# Altium schematic sheet main.SchDoc: LoRaWAN Gateway
size A4; DrawnBy: Lucas Liaño; Organization: UTN-FRBA; Revision: 1; SheetNumber: 1; SheetTotal: 1
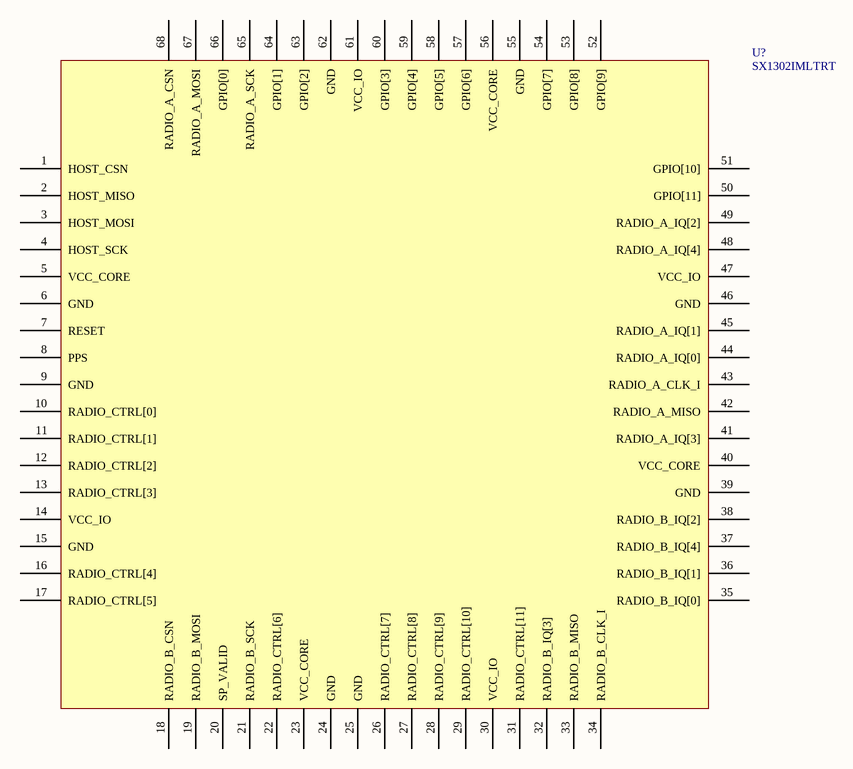
[diagram p0: main.SchDoc]

## Parts
U?  SX1302IMLTRT

## Nets

Not connected (* = marked no-connect by the designer): U? 1(HOST_CSN) 2(HOST_MISO) 3(HOST_MOSI) 4(HOST_SCK) 5(VCC_CORE) 6(GND) 7(RESET) 8(PPS) 9(GND) 10(RADIO_CTRL[0]) 11(RADIO_CTRL[1]) 12(RADIO_CTRL[2]) 13(RADIO_CTRL[3]) 14(VCC_IO) 15(GND) 16(RADIO_CTRL[4]) 17(RADIO_CTRL[5]) 18(RADIO_B_CSN) 19(RADIO_B_MOSI) 20(SP_VALID) 21(RADIO_B_SCK) 22(RADIO_CTRL[6]) 23(VCC_CORE) 24(GND) 25(GND) 26(RADIO_CTRL[7]) 27(RADIO_CTRL[8]) 28(RADIO_CTRL[9]) 29(RADIO_CTRL[10]) 30(VCC_IO) 31(RADIO_CTRL[11]) 32(RADIO_B_IQ[3]) 33(RADIO_B_MISO) 34(RADIO_B_CLK_I) 35(RADIO_B_IQ[0]) 36(RADIO_B_IQ[1]) 37(RADIO_B_IQ[4]) 38(RADIO_B_IQ[2]) 39(GND) 40(VCC_CORE) 41(RADIO_A_IQ[3]) 42(RADIO_A_MISO) 43(RADIO_A_CLK_I) 44(RADIO_A_IQ[0]) 45(RADIO_A_IQ[1]) 46(GND) 47(VCC_IO) 48(RADIO_A_IQ[4]) 49(RADIO_A_IQ[2]) 50(GPIO[11]) 51(GPIO[10]) 52(GPIO[9]) 53(GPIO[8]) 54(GPIO[7]) 55(GND) 56(VCC_CORE) 57(GPIO[6]) 58(GPIO[5]) 59(GPIO[4]) 60(GPIO[3]) 61(VCC_IO) 62(GND) 63(GPIO[2]) 64(GPIO[1]) 65(RADIO_A_SCK) 66(GPIO[0]) 67(RADIO_A_MOSI) 68(RADIO_A_CSN)

## Library data of the parts
U? = SX1302: LoRa Core™ Digital Baseband Chip for LoRaWAN network gateways; Manufacturer: Semtech; ComponentLink1Description: Datasheet; ComponentLink1URL: https://media.digikey.com/pdf/Data%20Sheets/Semtech%20PDFs/SX1302_rev1.1_Jan2020.pdf; ComponentLink2Description: SupplierLink; ComponentLink2URL: https://www.digikey.com/en/products/detail/SX1302IMLTRT/600-SX1302IMLTRTCT-ND/10379524?WT.z_cid=ref_netcomponents_dkc_buynow&utm_source=netcomponents&utm_medium=aggregator&utm_campaign=buynow; MPN: SX1302; Package: QFN 7x7mm P=0.35mm; Price (USD): 37.75; Value: -